# EAGLE design USBHume2 (EAGLE 7.5.0)
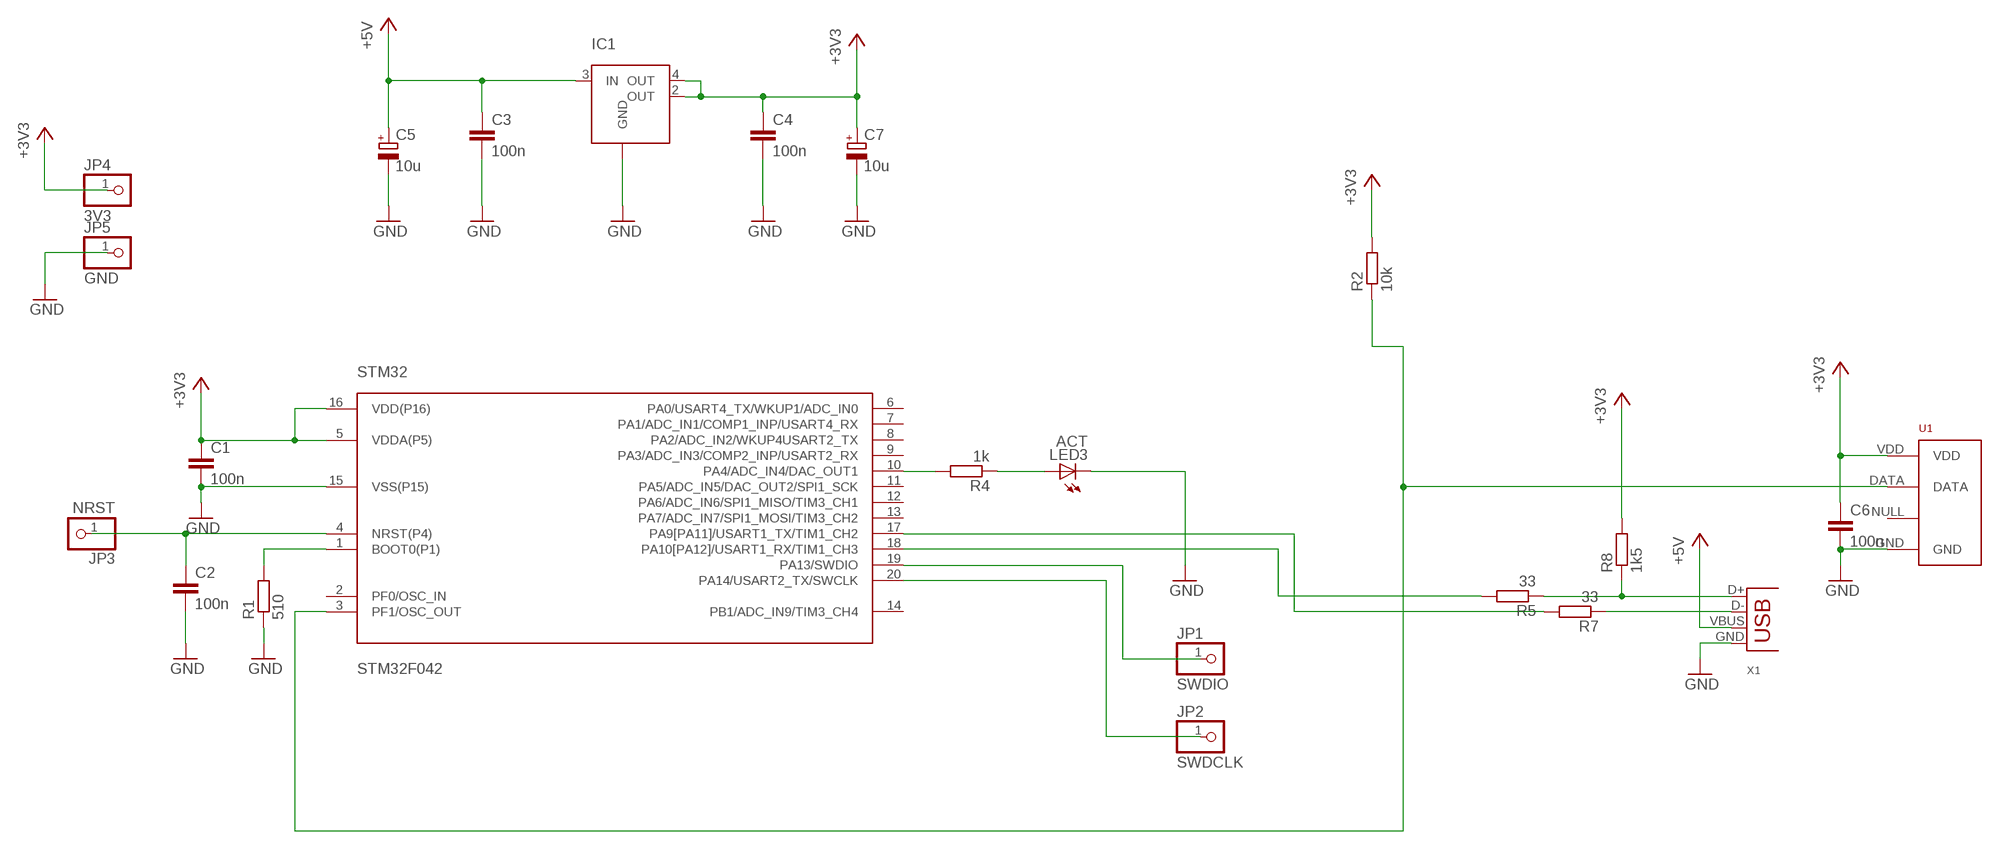
[diagram p0: schematic, sheet 1]

## Parts
C1  100n  C-EUC0805  [C0805]
C2  100n  C-EUC0805  [C0805]
C3  100n  C-EUC0805  [C0805]
C4  100n  C-EUC0805  [C0805]
C5  10u  CPOL-EUA/3216-18W  [A/3216-18W]
C6  100n  C-EUC0805  [C0805]
C7  10u  CPOL-EUA/3216-18W  [A/3216-18W]
IC1  LM1117MP-3.3  [SOT223]
JP1  SWDIO  PINHD-1X1  [1X01]
JP2  SWDCLK  PINHD-1X1  [1X01]
JP3  NRST  PINHD-1X1  [1X01]
JP4  3V3  PINHD-1X1  [1X01]
JP5  GND  PINHD-1X1  [1X01]
LED3  ACT  LEDCHIPLED_0805  [CHIPLED_0805]
R1  510  R-EU_M0805  [M0805]
R2  10k  R-EU_M0805  [M0805]
R4  1k  R-EU_M0805  [M0805]
R5  33  R-EU_M0805  [M0805]
R7  33  R-EU_M0805  [M0805]
R8  1k5  R-EU_M0805  [M0805]
STM32  STM32F042  [TSSOP20]
U1  RHT03_DHT-22_AM2302WIRED  [AM2302]
X1  USB-A-H  [USB-A-H]

## Nets
+3V3: C1.1 C4.1 C6.1 C7.+ IC1.2(OUT) IC1.4(OUT) JP4.1 R2.2 R8.2 STM32.5(VDDA(P5)) STM32.16(VDD(P16)) U1.VDD
+5V: C3.1 C5.+ IC1.3(IN) X1.VBUS
GND: C1.2 C2.2 C3.2 C4.2 C5.- C6.2 C7.- IC1.1(GND) JP5.1 LED3.C R1.1 STM32.15(VSS(P15)) U1.GND X1.GND
N$1: R2.1 STM32.3(PF1/OSC_OUT) U1.DATA
N$2: R4.2 STM32.10(PA4/ADC_IN4/DAC_OUT1)
N$3: R7.2 STM32.17(PA9[PA11]/USART1_TX/TIM1_CH2)
N$5: R5.2 STM32.18(PA10[PA12]/USART1_RX/TIM1_CH3)
N$7: R1.2 STM32.1(BOOT0(P1))
N$9: JP1.1 STM32.19(PA13/SWDIO)
N$10: JP2.1 STM32.20(PA14/USART2_TX/SWCLK)
N$14: LED3.A R4.1
N$15: C2.1 JP3.1 STM32.4(NRST(P4))
N$16: R7.1 X1.D-
N$17: R5.1 R8.1 X1.D+
Unconnected: STM32.2(PF0/OSC_IN) STM32.6(PA0/USART4_TX/WKUP1/ADC_IN0) STM32.7(PA1/ADC_IN1/COMP1_INP/USART4_RX) STM32.8(PA2/ADC_IN2/WKUP4USART2_TX) STM32.9(PA3/ADC_IN3/COMP2_INP/USART2_RX) STM32.11(PA5/ADC_IN5/DAC_OUT2/SPI1_SCK) STM32.12(PA6/ADC_IN6/SPI1_MISO/TIM3_CH1) STM32.13(PA7/ADC_IN7/SPI1_MOSI/TIM3_CH2) STM32.14(PB1/ADC_IN9/TIM3_CH4) U1.NULL

## Library data of the parts
C1-C4 C6 = rcl:C-EU: CAPACITOR, European symbol
C5 C7 = rcl:CPOL-EU: POLARIZED CAPACITOR, European symbol
IC1 = lm1117mp:LM1117MP-3.3
JP1-JP5 = pinhead:PINHD-1X1: PIN HEADER
LED3 = led:LED: LED OSRAM: - CHIPLED LG R971, LG N971, LY N971, LG Q971, LY Q971, LO R971, LY R971 LH N974, LH R974 LS Q976, LO Q976, LY Q976 LO Q996 - Hyper CHIPLED LW Q18S LB Q993, LB Q99A, LB R99A - SideLED LS A670, LO A670, LY A670, LG A670, LP A670 LB A673, LV A673, LT A673, LW A673 LH A674 LY A675 LS A676, LA A676, LO A676, LY A676, LW A676 LS A679, LY A679, LG A679 - Hyper Micro SIDELED® LS Y876, LA Y876, LO Y876, LY Y876 LT Y87S - SmartLED LW L88C, LW L88S LB L89C, LB L89S, LG L890 LS L89K, LO L89K, LY L89K LS L896, LA L896, LO L896, LY L896 - TOPLED LS T670, LO T670, LY T670, LG T670, LP T670 LSG T670, LSP T670, LSY T670, LOP T670, LYG T670 LG T671, LOG T671, LSG T671 LB T673, LV T673, LT T673, LW T673 LH T674 LS T676, LA T676, LO T676, LY T676, LB T676, LH T676, LSB T676, LW T676 LB T67C, LV T67C, LT T67C, LS T67K, LO T67K, LY T67K, LW E67C LS E67B, LA E67B, LO E67B, LY E67B, LB E67C, LV E67C, LT E67C LW T67C LS T679, LY T679, LG T679 LS T770, LO T770, LY T770, LG T770, LP T770 LB T773, LV T773, LT T773, LW T773 LH T774 LS E675, LA E675, LY E675, LS T675 LS T776, LA T776, LO T776, LY T776, LB T776 LHGB T686 LT T68C, LB T68C - Hyper Mini TOPLED® LB M676 - Mini TOPLED Santana® LG M470 LS M47K, LO M47K, LY M47K Source: http://www.osram.convergy.de LUXEON: - LUMILED® LXK2-PW12-R00, LXK2-PW12-S00, LXK2-PW14-U00, LXK2-PW14-V00 LXK2-PM12-R00, LXK2-PM12-S00, LXK2-PM14-U00 LXK2-PE12-Q00, LXK2-PE12-R00, LXK2-PE12-S00, LXK2-PE14-T00, LXK2-PE14-U00 LXK2-PB12-K00, LXK2-PB12-L00, LXK2-PB12-M00, LXK2-PB14-N00, LXK2-PB14-P00, LXK2-PB14-Q00 LXK2-PR12-L00, LXK2-PR12-M00, LXK2-PR14-Q00, LXK2-PR14-R00 LXK2-PD12-Q00, LXK2-PD12-R00, LXK2-PD12-S00 LXK2-PH12-R00, LXK2-PH12-S00 LXK2-PL12-P00, LXK2-PL12-Q00, LXK2-PL12-R00 Source: www.luxeon.com KINGBRIGHT: KA-3528ASYC Source: www.kingbright.com
R1 R2 R4 R5 R7 R8 = rcl:R-EU_: RESISTOR, European symbol
STM32 = stm32f0:STM32F042
U1 = RHT03_DHT-22_AM2302:RHT03_DHT-22_AM2302: RHT03 / DHT-22 / AM2302 Packages and symbol for the RHT03 / DHT-22 relative humidity and temperature sensor. Note: The AM2302 is a wired version of the DHT-22 which typically requires less clearance and is thus provided as a separate package.; PROD_ID: SEN-10167
X1 = con-usb-3:USB: USB Connectors

## Board
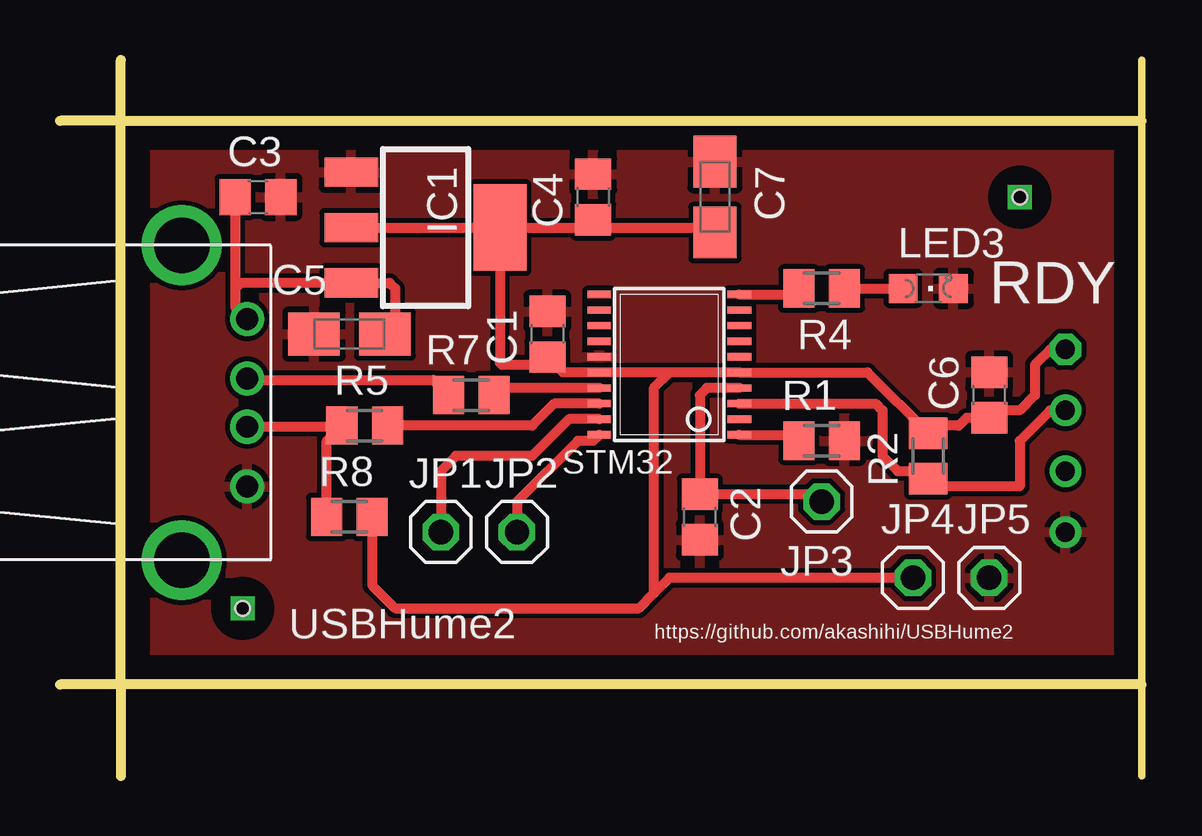
[diagram p1: board, top side]
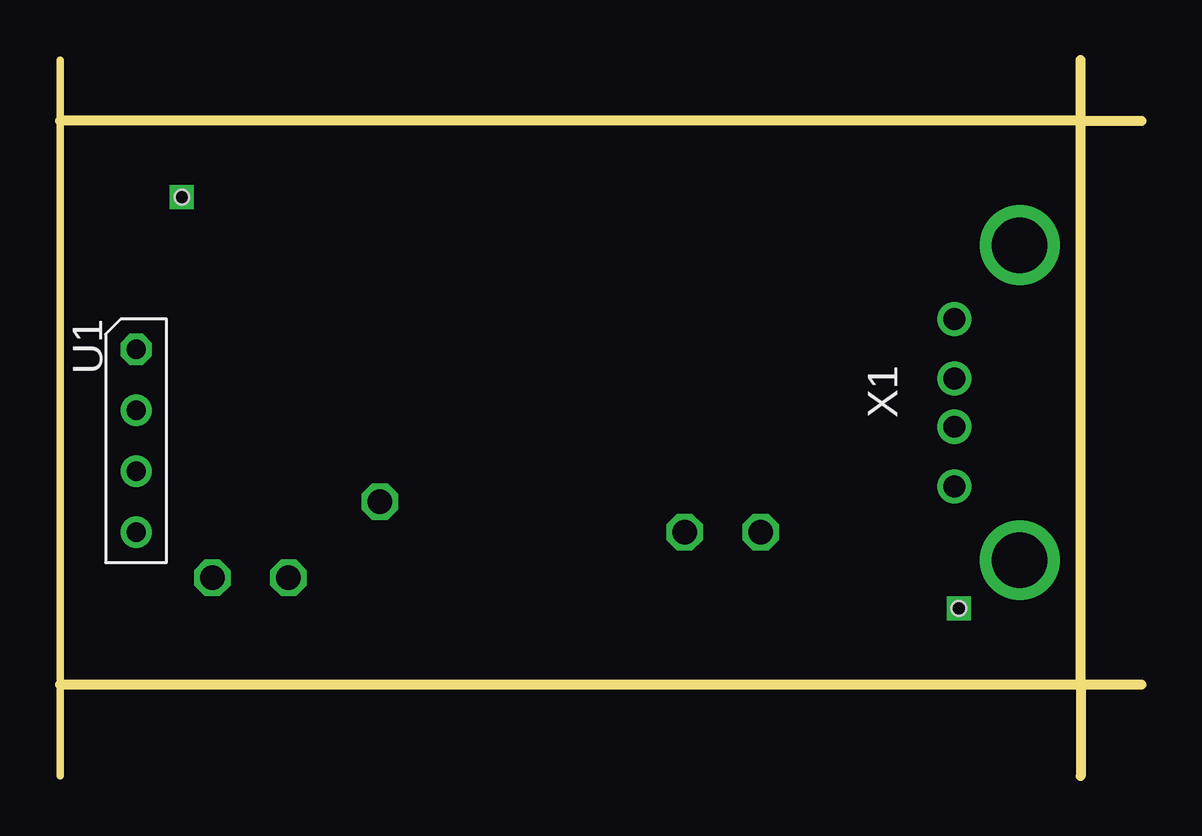
[diagram p2: board, bottom side, seen from below]

Size 45.09 x 29.84 mm. Coordinates in mm from the lower left corner, seen from the top.
Outline: 2.54,3.81 2.54,27.3
Outline: 2.54,27.3 45.09,27.3
Outline: 45.09,3.81 2.54,3.81
Outline: 2.54,27.3 2.54,29.84
Outline: 2.54,27.3 0,27.3
Outline: 2.54,3.81 2.54,0
Outline: 2.54,3.81 0,3.81
Outline: 45.09,29.84 45.09,0
Copper layers (1*16): Top 0.035mm / dielectric 1.5mm / Bottom 0.035mm
Design rules "default": minimum track width 10mil, minimum drill 24mil, track to track 8mil, track to pad 8mil, pad to pad 8mil, via to via 8mil, smd to smd 8mil, copper to edge 40mil, drill to drill 8mil, minimum pad ring 10mil, minimum via ring 8mil, stop-mask expansion 4mil, vias tented up to drill 0mil, thermal gap 10mil
Holes 0.6 mm at 7.62,6.99 40.01,24.13

### Footprints (pad centres in the part's own frame; a part is rotated, then mirrored left to right if it is on the bottom)
C0805 = smd 1.3 x 1.5: 1 -0.95,0; 2 0.95,0
A/3216-18W = smd 2.15 x 1.8: + 1.475,0; - -1.475,0
SOT223 = smd 1.219 x 2.235: 1 -2.311,-3.099; 2 0,-3.099; 3 2.311,-3.099 | smd 3.6 x 2.2: 4 0,3.099
1X01 = drill 1.016 octagon: 1 0,0
CHIPLED_0805 = smd 1.2 x 1.2: A 0,-1.05; C 0,1.05
M0805 = smd 1.3 x 1.6: 1 -0.95,0; 2 0.95,0
TSSOP20 = smd 0.305 x 0.991: 1 -2.925,-2.918; 2 -2.275,-2.918; 3 -1.625,-2.918; 4 -0.975,-2.918; 5 -0.325,-2.918; 6 0.325,-2.918; 7 0.975,-2.918; 8 1.625,-2.918; 9 2.275,-2.918; 10 2.925,-2.918; 11 2.925,2.918; 12 2.275,2.918; 13 1.625,2.918; 14 0.975,2.918; 15 0.325,2.918; 16 -0.325,2.918; 17 -0.975,2.918; 18 -1.625,2.918; 19 -2.275,2.918; 20 -2.925,2.918
AM2302 = drill 0.8: DATA -1.27,0; GND 3.81,0; NULL 1.27,0 | drill 0.8 octagon: VDD -3.81,0
USB-A-H = drill 0.914: D+ 2.718,-1.003; D- 2.718,1.003; GND 2.718,-3.493; VBUS 2.718,3.493 | drill 2.311: P$5 0,-6.566; P$6 0,6.566

### Placement (x,y rotation side)
C1  20.32,18.41 90 top
C2  26.67,10.79 270 top
C3  8.26,24.13 0 top
C4  22.23,24.13 90 top
C5  12.06,18.41 0 top
C6  38.73,15.88 90 top
C7  27.3,24.13 270 top
IC1  15.24,22.86 270 top
JP1  15.88,10.16 0 top
JP2  19.05,10.16 0 top
JP3  31.75,11.43 180 top
JP4  35.56,8.26 0 top
JP5  38.73,8.26 0 top
LED3  36.2,20.32 270 top
R1  31.75,13.97 180 top
R2  36.2,13.34 90 top
R4  31.75,20.32 180 top
R5  12.7,14.61 0 top
R7  17.14,15.88 0 top
R8  12.06,10.79 0 top
STM32  25.4,17.14 90 top
U1  41.91,13.97 270 bottom
X1  5.08,15.56 0 top

### Tracks (layer width: path | path; a pad name or v marks a point on that pad's centre or on a via)
+3V3
  Top 0.406: 25.4,16.82 STM32.5 33.66,16.82 R2.2 36.52,14.61 37.47,14.61 37.78,14.93 C6.1 39.05,15.24 40.01,15.24 40.64,15.88 40.64,17.14 41.27,17.78 U1.VDD | 25.4,16.82 STM32.16 20.96,16.82 C1.1 20,17.14 18.41,17.14 18.34,17.22 IC1.4 | IC1.2 IC1.4 | IC1.4 21.91,22.86 C4.1 22.55,22.86 27.1,22.86 C7.+ | R8.2 13.02,7.94 13.97,6.99 24.13,6.99 24.77,7.62 | 24.77,7.62 24.77,16.18 25.4,16.82 | JP4.1 25.4,8.26 24.77,7.62
+5V
  Top 0.406: C5.+ 13.97,18.84 13.97,20.32 13.74,20.55 IC1.3 7.53,20.55 7.3,20.32 | C3.1 7.3,20.32 | 7.3,20.32 7.3,19.54 X1.VBUS
GND
  pour Top: 2.54,27.3 45.09,27.3 45.09,3.81 2.54,3.81
N$1
  Top 0.406: U1.DATA 41.27,15.24 40.01,13.97 40.01,12.06 36.52,12.06 R2.1 35.88,12.7 34.92,12.7 34.29,13.34 34.29,15.24 34.01,15.52 STM32.3
N$2
  Top 0.406: STM32.10 30.8,20.07 R4.2
N$3
  Top 0.406: STM32.17 18.39,16.17 R7.2
N$4  (via drill 0.6 pad 0.61)
  other vias: 7.62,6.99
N$5
  Top 0.406: STM32.18 20.6,15.52 19.68,14.61 R5.2
N$7
  Top 0.406: STM32.1 30.55,14.22 R1.2
N$8  (via drill 0.6 pad 0.61)
  other vias: 40.01,24.13
N$9
  Top 0.406: STM32.19 21.22,14.87 19.68,13.34 16.51,13.34 15.88,12.7 JP1.1
N$10
  Top 0.406: STM32.20 22.23,13.96 21.6,13.96 21.59,13.97 19.05,11.43 JP2.1
N$14
  Top 0.406: R4.1 LED3.A
N$15
  Top 0.406: STM32.4 26.96,16.17 26.67,15.88 C2.1 31.43,11.74 JP3.1
N$16
  Top 0.406: X1.D- 8.2,16.56 8.26,16.51 15.56,16.51 R7.1
N$17
  Top 0.406: X1.D+ 11.7,14.55 R5.1 11.12,13.97 R8.1

### Text on the board
tNames: RDY | USBHume2 | https://github.com/akashihi/USBHume2